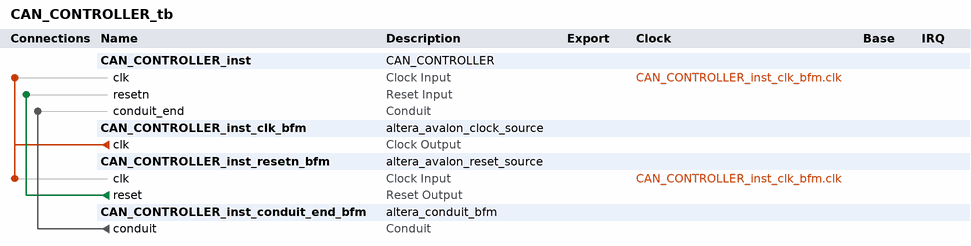
[diagram p0: system contents]
# Platform Designer (Qsys) system CAN_CONTROLLER_tb, Cyclone IV GX Unknown
# Parameters at their usual value, and those the tool derives, are not listed.
package require -exact qsys 13.1
create_system CAN_CONTROLLER_tb
set_project_property DEVICE_FAMILY {Cyclone IV GX}
set_project_property DEVICE Unknown

add_instance CAN_CONTROLLER_inst CAN_CONTROLLER 1.0

add_instance CAN_CONTROLLER_inst_clk_bfm altera_avalon_clock_source 13.1

add_instance CAN_CONTROLLER_inst_resetn_bfm altera_avalon_reset_source 13.1
set_instance_parameter_value CAN_CONTROLLER_inst_resetn_bfm ASSERT_HIGH_RESET 0
set_instance_parameter_value CAN_CONTROLLER_inst_resetn_bfm INITIAL_RESET_CYCLES 50

add_instance CAN_CONTROLLER_inst_conduit_end_bfm altera_conduit_bfm 13.1
set_instance_parameter_value CAN_CONTROLLER_inst_conduit_end_bfm CLOCKED_SIGNAL false
set_instance_parameter_value CAN_CONTROLLER_inst_conduit_end_bfm ENABLE_RESET false
set_instance_parameter_value CAN_CONTROLLER_inst_conduit_end_bfm SIGNAL_ROLES rx_i,tx_o,bus_off_on,irq_on,clkout_o
set_instance_parameter_value CAN_CONTROLLER_inst_conduit_end_bfm SIGNAL_WIDTHS 1,1,1,1,1
set_instance_parameter_value CAN_CONTROLLER_inst_conduit_end_bfm SIGNAL_DIRECTIONS output,input,input,input,input

# connections
add_connection CAN_CONTROLLER_inst_clk_bfm.clk CAN_CONTROLLER_inst.clk clock
add_connection CAN_CONTROLLER_inst_clk_bfm.clk CAN_CONTROLLER_inst_resetn_bfm.clk clock
add_connection CAN_CONTROLLER_inst_resetn_bfm.reset CAN_CONTROLLER_inst.resetn reset
add_connection CAN_CONTROLLER_inst_conduit_end_bfm.conduit CAN_CONTROLLER_inst.conduit_end conduit

set_interconnect_requirement {$system} qsys_mm.clockCrossingAdapter HANDSHAKE
set_interconnect_requirement {$system} qsys_mm.maxAdditionalLatency 1
set_interconnect_requirement {$system} qsys_mm.insertDefaultSlave false

save_system CAN_CONTROLLER_tb.qsys
